# EAGLE schematic midi2cv (EAGLE 9.6.2)
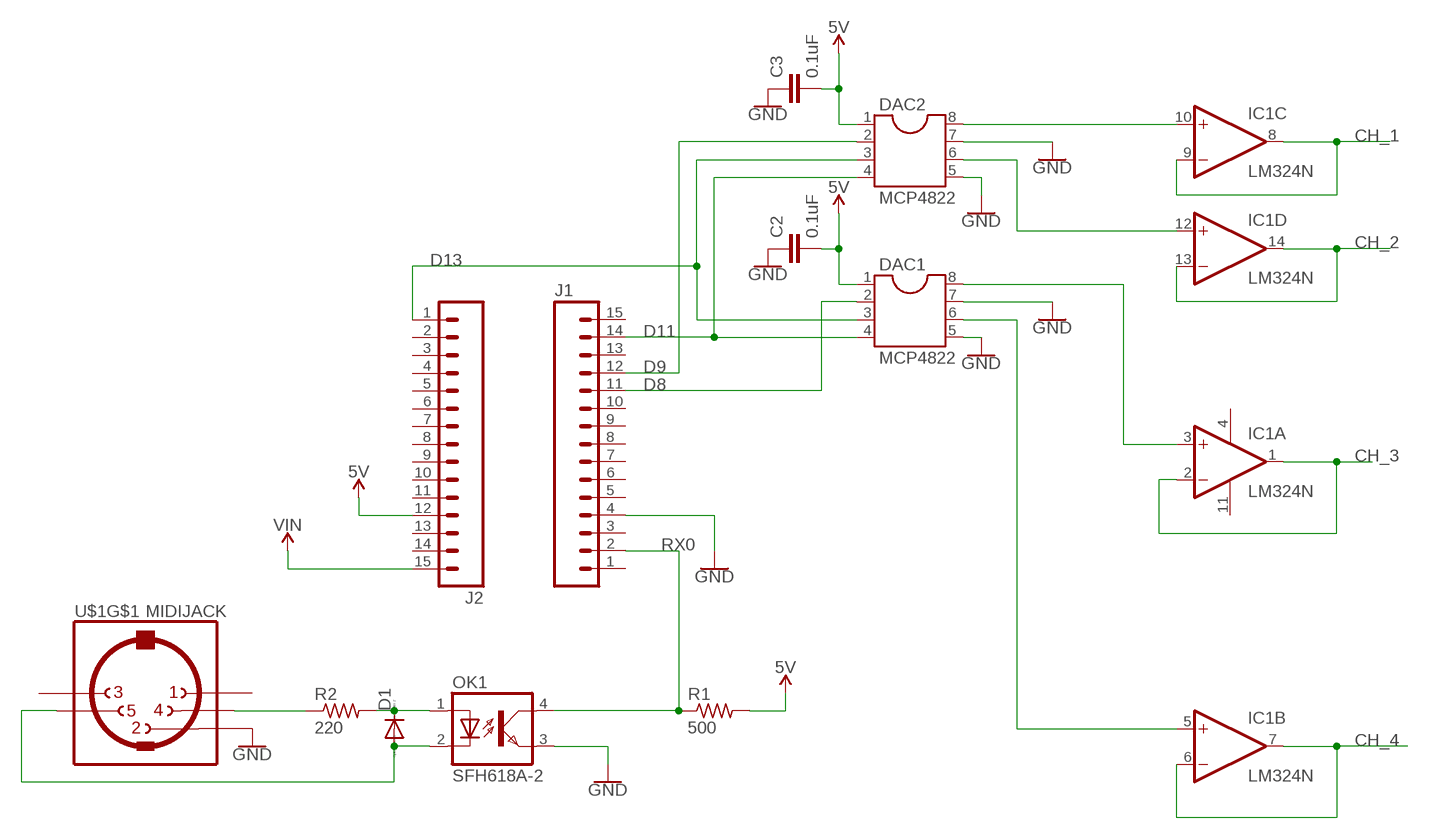
[diagram p0: schematic, sheet 1]

## Parts
C2  0.1uF  0.1UF-KIT-EZ-50V-20%  [CAP-PTH-SMALL-KIT]
C3  0.1uF  0.1UF-KIT-EZ-50V-20%  [CAP-PTH-SMALL-KIT]
D1  DIODE-D-10  [D-10]
DAC1  MCP4822  DIL8S  [SOCKET-08]
DAC2  MCP4822  DIL8S  [SOCKET-08]
IC1  LM324N  [DIL14]
J1  M15  [1X15]
J2  M15  [1X15]
OK1  SFH618A-2  [DIP4]
R1  500  R-US_0207/10  [0207/10]
R2  220  R-US_0207/10  [0207/10]
U$1  MIDIJACK  [CP-2350]

## Nets
5V: C2.2 C3.2 DAC1.1 DAC2.1 J2.12 R1.2
CH_1: IC1.8(C:OUT) IC1.9(C:-IN)
CH_2: IC1.13(D:-IN) IC1.14(D:OUT)
CH_3: IC1.1(A:OUT) IC1.2(A:-IN)
CH_4: IC1.6(B:-IN) IC1.7(B:OUT)
D8: DAC1.2 J1.11
D9: DAC2.2 J1.12
D11: DAC1.4 DAC2.4 J1.14
D13: DAC1.3 DAC2.3 J2.1
GND: C2.1 C3.1 DAC1.5 DAC1.7 DAC2.5 DAC2.7 J1.4 OK1.3(EMIT) U$1.2
N$1: D1.C OK1.1(A) R2.2
N$2: D1.A OK1.2(C) U$1.5
N$3: R2.1 U$1.4
N$4: DAC1.8 IC1.3(A:+IN)
N$7: DAC1.6 IC1.5(B:+IN)
N$8: DAC2.8 IC1.10(C:+IN)
N$9: DAC2.6 IC1.12(D:+IN)
RX0: J1.2 OK1.4(COL) R1.1
VIN: J2.15
Unconnected: J1.1 J1.3 J1.5 J1.6 J1.7 J1.8 J1.9 J1.10 J1.13 J1.15 J2.2 J2.3 J2.4 J2.5 J2.6 J2.7 J2.8 J2.9 J2.10 J2.11 J2.13 J2.14 U$1.1 U$1.3 U$1.PE1(MT) U$1.PE2(MT) U$1.PE(MT) U$1.PE@(MT)

## Power pins joined to a net without a drawn wire
V+: IC1.4(P:V+)
V-: IC1.11(P:V-)

## Library data of the parts
C2 C3 = SparkFun-Capacitors:0.1UF: 0.1µF ceramic capacitors A capacitor is a passive two-terminal electrical component used to store electrical energy temporarily in an electric field.; PROD_ID: CAP-08370
D1 = diode:DIODE-: DIODE
DAC1 DAC2 = ic-package:DIL8: Dual In Line / Socket
IC1 = linear:LM324: OP AMP
J1 J2 = SparkFun-Connectors:M15: Header 15 Standard 15-pin 0.1" header. Use with straight break away headers (SKU : PRT-00116), right angle break away headers (PRT-00553), swiss pins (PRT-00743), machine pins (PRT-00117), and female headers (PRT-00115).
OK1 = optocoupler:SFH618?*: Optocoupler, Phototransistor Output, Low Input Current Source: Data sheet <http://www.vishay.com/docs/83673/sfh618.pdf>; MF: VISHAY/TELEFUNKEN; MPN: SFH618A-2; OC_FARNELL: 6424855; OC_NEWARK: 21H7744
R1 R2 = resistor:R-US_: RESISTOR, American symbol
U$1 = adafruit:MIDIJACK: DIN 5 jack also known as MIDI jack A modification of conn-hirshman:MAB5SH with two options for the grounding 'teeth'